# EAGLE design Midiot (EAGLE 5.10)

## Sheet 1 of 3
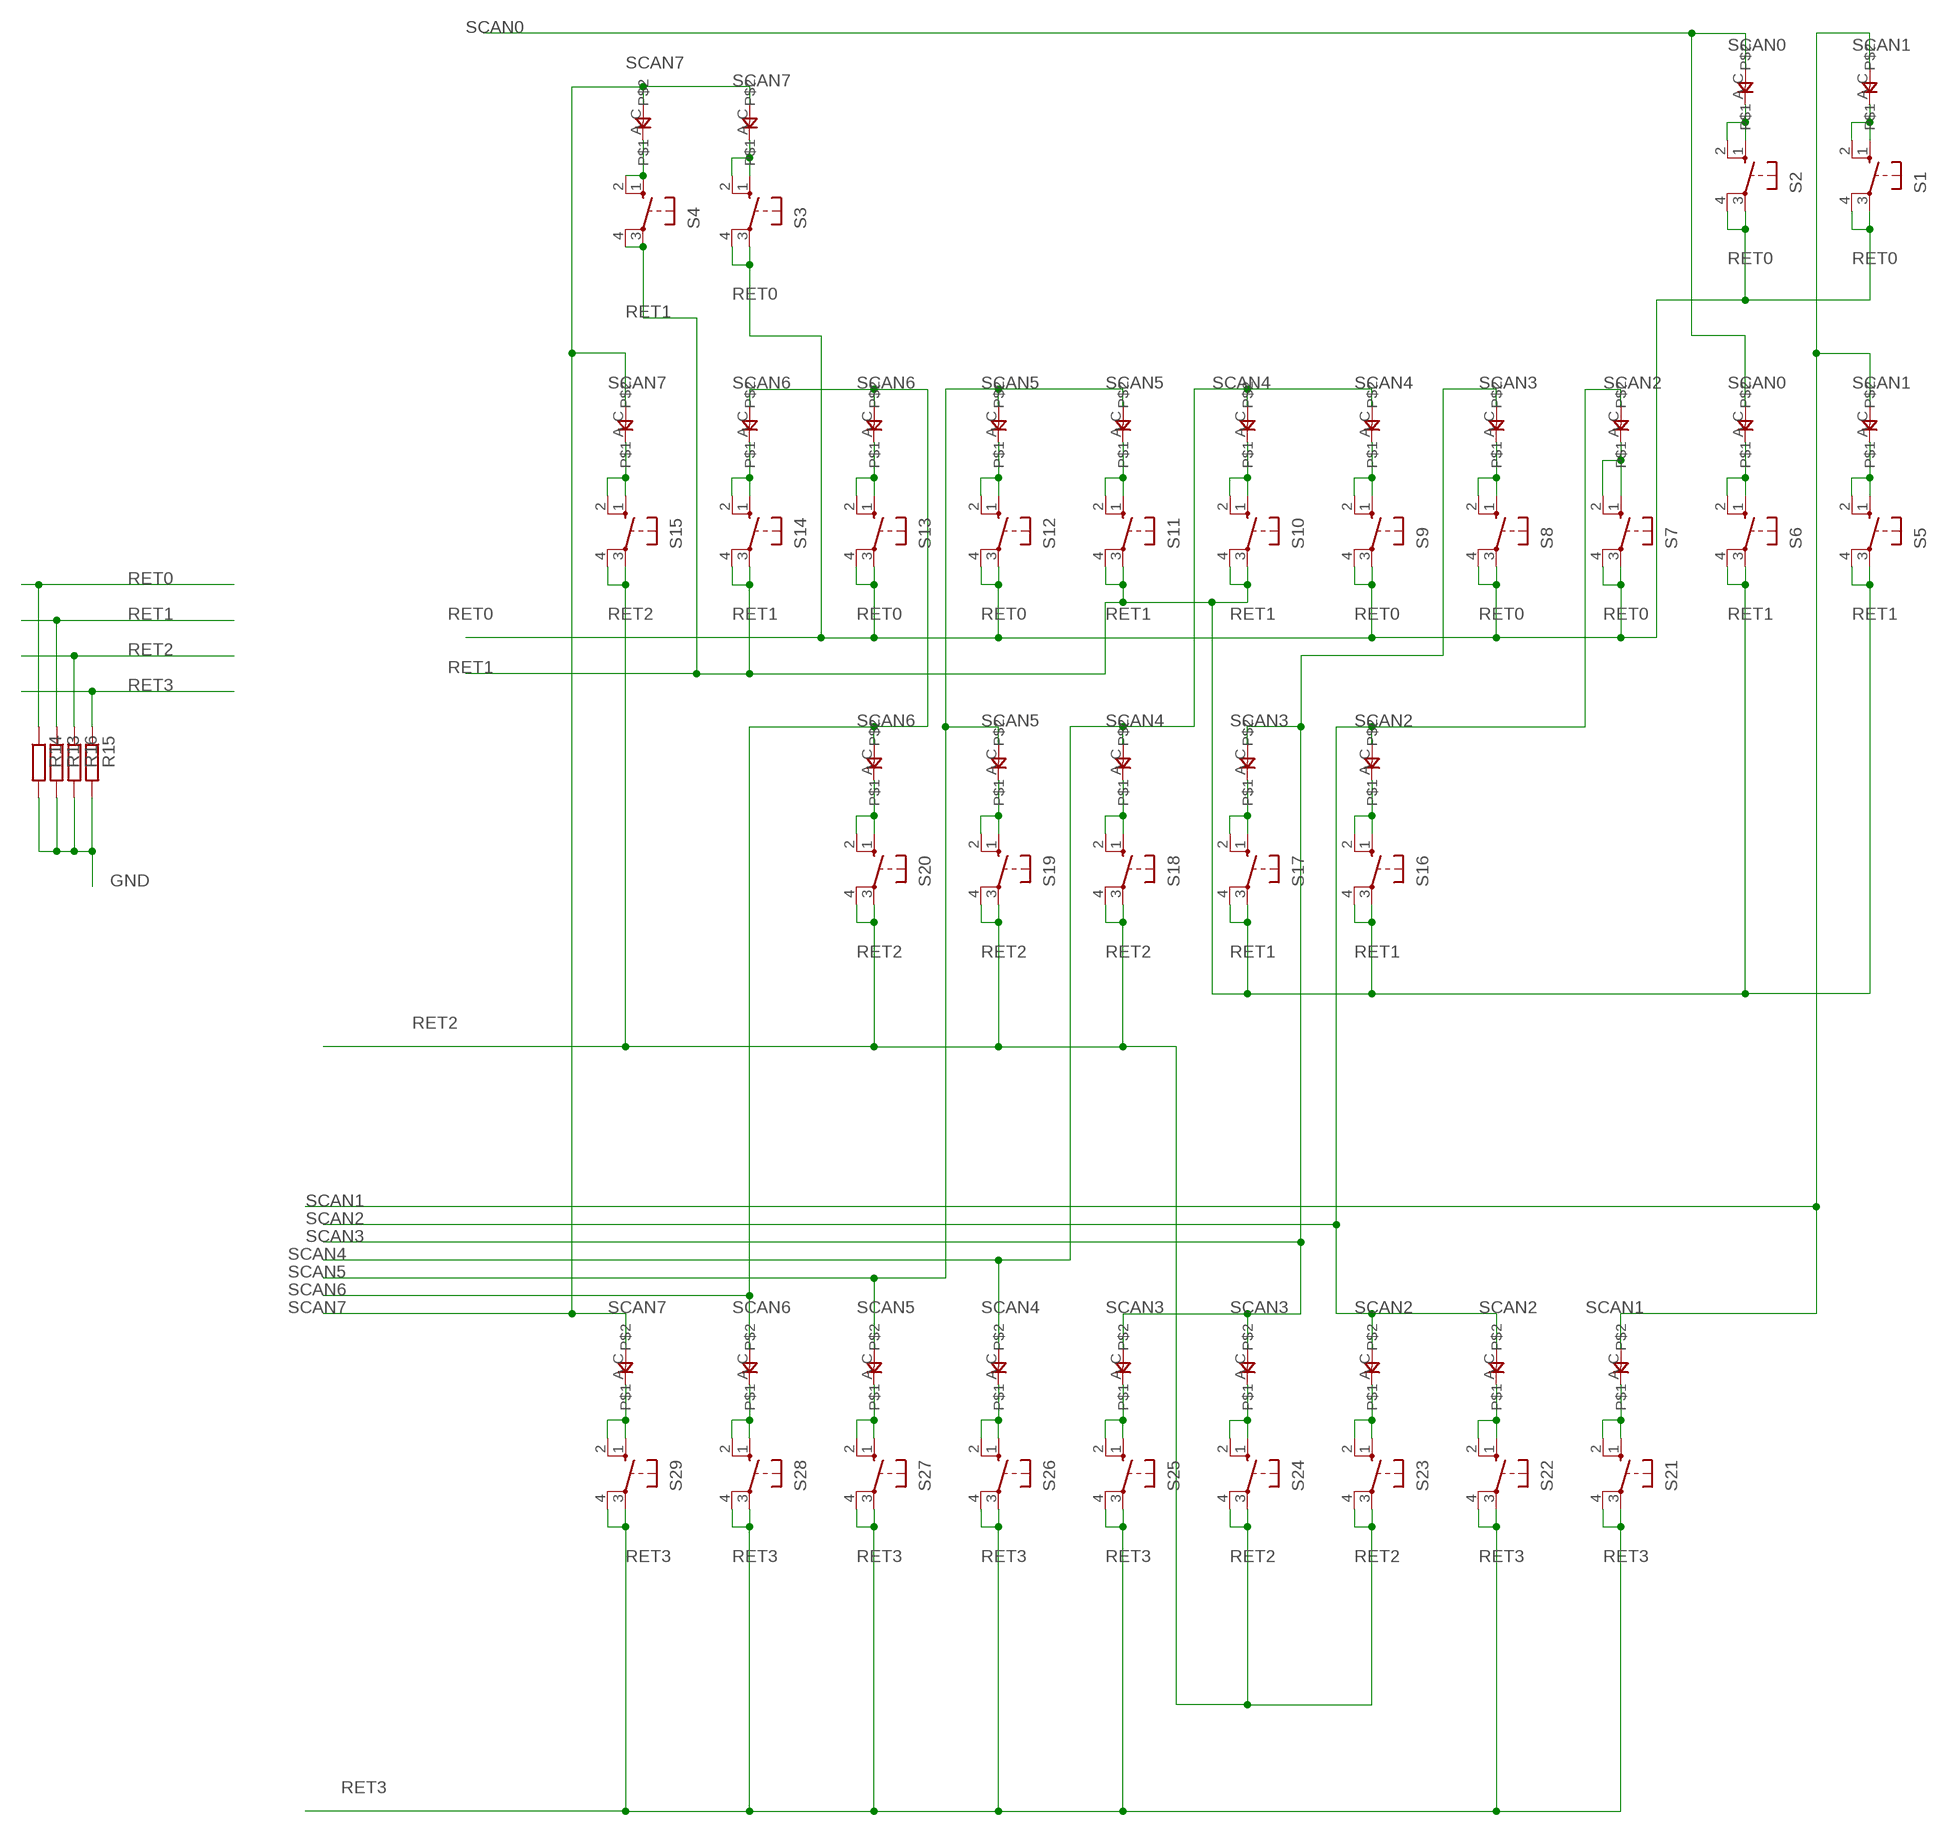
[diagram p0: schematic, sheet 1]

### Parts
R13  R-EU_R0805  [R0805]
R14  R-EU_R0805  [R0805]
R15  R-EU_R0805  [R0805]
R16  R-EU_R0805  [R0805]
S1  40-XX  [B3F-40XX]
S2  40-XX  [B3F-40XX]
S3  40-XX  [B3F-40XX]
S4  40-XX  [B3F-40XX]
S5  40-XX  [B3F-40XX]
S6  40-XX  [B3F-40XX]
S7  40-XX  [B3F-40XX]
S8  40-XX  [B3F-40XX]
S9  40-XX  [B3F-40XX]
S10  40-XX  [B3F-40XX]
S11  40-XX  [B3F-40XX]
S12  40-XX  [B3F-40XX]
S13  40-XX  [B3F-40XX]
S14  40-XX  [B3F-40XX]
S15  40-XX  [B3F-40XX]
S16  40-XX  [B3F-40XX]
S17  40-XX  [B3F-40XX]
S18  40-XX  [B3F-40XX]
S19  40-XX  [B3F-40XX]
S20  40-XX  [B3F-40XX]
S21  40-XX  [B3F-40XX]
S22  40-XX  [B3F-40XX]
S23  40-XX  [B3F-40XX]
S24  40-XX  [B3F-40XX]
S25  40-XX  [B3F-40XX]
S26  40-XX  [B3F-40XX]
S27  40-XX  [B3F-40XX]
S28  40-XX  [B3F-40XX]
S29  40-XX  [B3F-40XX]
U$1  0805DIODE  [0805DIODE]
U$5  0805DIODE  [0805DIODE]
U$6  0805DIODE  [0805DIODE]
U$7  0805DIODE  [0805DIODE]
U$8  0805DIODE  [0805DIODE]
U$9  0805DIODE  [0805DIODE]
U$10  0805DIODE  [0805DIODE]
U$11  0805DIODE  [0805DIODE]
U$12  0805DIODE  [0805DIODE]
U$13  0805DIODE  [0805DIODE]
U$14  0805DIODE  [0805DIODE]
U$15  0805DIODE  [0805DIODE]
U$16  0805DIODE  [0805DIODE]
U$17  0805DIODE  [0805DIODE]
U$18  0805DIODE  [0805DIODE]
U$19  0805DIODE  [0805DIODE]
U$20  0805DIODE  [0805DIODE]
U$21  0805DIODE  [0805DIODE]
U$22  0805DIODE  [0805DIODE]
U$23  0805DIODE  [0805DIODE]
U$24  0805DIODE  [0805DIODE]
U$25  0805DIODE  [0805DIODE]
U$26  0805DIODE  [0805DIODE]
U$27  0805DIODE  [0805DIODE]
U$28  0805DIODE  [0805DIODE]
U$29  0805DIODE  [0805DIODE]
U$30  0805DIODE  [0805DIODE]
U$31  0805DIODE  [0805DIODE]
U$32  0805DIODE  [0805DIODE]

### Nets
GND: R13.2 R14.2 R15.2 R16.2 ; also sheet 2,3
N$6: S3.1(S) S3.2(S1) U$30.A
N$13: S2.1(S) S2.2(S1) U$31.A
N$14: S1.1(S) S1.2(S1) U$32.A
N$15: S4.1(S) S4.2(S1) U$29.A
N$16: S7.1(S) S7.2(S1) U$26.A
N$17: S5.1(S) S5.2(S1) U$28.A
N$18: S15.1(S) S15.2(S1) U$18.A
N$19: S14.1(S) S14.2(S1) U$19.A
N$20: S9.1(S) S9.2(S1) U$24.A
N$21: S10.1(S) S10.2(S1) U$23.A
N$22: S6.1(S) S6.2(S1) U$27.A
N$23: S11.1(S) S11.2(S1) U$22.A
N$24: S12.1(S) S12.2(S1) U$21.A
N$25: S13.1(S) S13.2(S1) U$20.A
N$26: S20.1(S) S20.2(S1) U$13.A
N$27: S19.1(S) S19.2(S1) U$14.A
N$28: S18.1(S) S18.2(S1) U$15.A
N$29: S17.1(S) S17.2(S1) U$16.A
N$30: S16.1(S) S16.2(S1) U$17.A
N$31: S28.1(S) S28.2(S1) U$5.A
N$32: S27.1(S) S27.2(S1) U$6.A
N$33: S29.1(S) S29.2(S1) U$1.A
N$34: S26.1(S) S26.2(S1) U$7.A
N$35: S25.1(S) S25.2(S1) U$8.A
N$36: S24.1(S) S24.2(S1) U$9.A
N$37: S23.1(S) S23.2(S1) U$10.A
N$38: S22.1(S) S22.2(S1) U$11.A
N$39: S21.1(S) S21.2(S1) U$12.A
N$40: S8.1(S) S8.2(S1) U$25.A
RET0: R14.1 S1.3(P) S1.4(P1) S2.3(P) S2.4(P1) S3.3(P) S3.4(P1) S7.3(P) S7.4(P1) S8.3(P) S8.4(P1) S9.3(P) S9.4(P1) S12.3(P) S12.4(P1) S13.3(P) S13.4(P1) ; also sheet 3
RET1: R13.1 S4.3(P) S4.4(P1) S5.3(P) S5.4(P1) S6.3(P) S6.4(P1) S10.3(P) S10.4(P1) S11.3(P) S11.4(P1) S14.3(P) S14.4(P1) S16.3(P) S16.4(P1) S17.3(P) S17.4(P1) ; also sheet 3
RET2: R16.1 S15.3(P) S15.4(P1) S18.3(P) S18.4(P1) S19.3(P) S19.4(P1) S20.3(P) S20.4(P1) S23.3(P) S23.4(P1) S24.3(P) S24.4(P1) ; also sheet 3
RET3: R15.1 S21.3(P) S21.4(P1) S22.3(P) S22.4(P1) S25.3(P) S25.4(P1) S26.3(P) S26.4(P1) S27.3(P) S27.4(P1) S28.3(P) S28.4(P1) S29.3(P) S29.4(P1) ; also sheet 3
SCAN0: U$27.C U$31.C ; also sheet 3
SCAN1: U$12.C U$28.C U$32.C ; also sheet 3
SCAN2: U$10.C U$11.C U$17.C U$26.C ; also sheet 2,3
SCAN3: U$8.C U$9.C U$16.C U$25.C ; also sheet 2,3
SCAN4: U$7.C U$15.C U$23.C U$24.C ; also sheet 2,3
SCAN5: U$6.C U$14.C U$21.C U$22.C ; also sheet 3
SCAN6: U$5.C U$13.C U$19.C U$20.C ; also sheet 2,3
SCAN7: U$1.C U$18.C U$29.C U$30.C ; also sheet 2,3

## Sheet 2 of 3
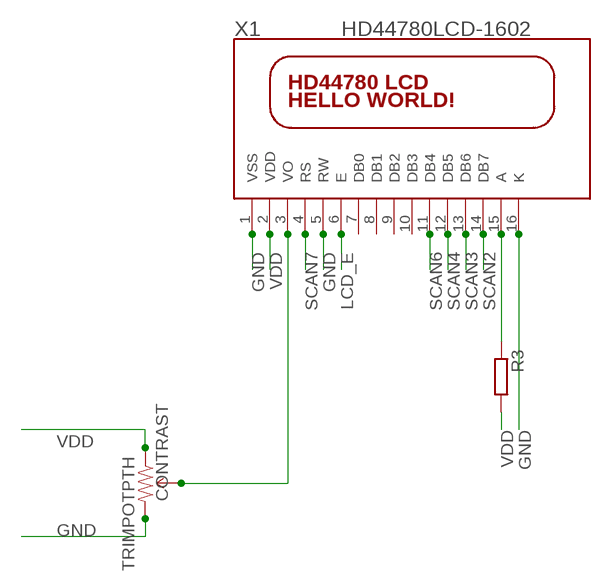
[diagram p1: schematic, sheet 2]

### Parts
CONTRAST  TRIMPOTPTH  [TRIM_POT_PTH]
R3  R-EU_R0805  [R0805]
X1  HD44780LCD-1602  [LCD1602]

### Nets
GND: CONTRAST.3(CW) X1.1(VSS) X1.5(RW) X1.16(K) ; also sheet 1,3
LCD_A: R3.1 X1.15(A)
LCD_E: X1.6(E) ; also sheet 3
LCD_VO: CONTRAST.2(WIPER) X1.3(VO)
SCAN2: X1.14(DB7) ; also sheet 1,3
SCAN3: X1.13(DB6) ; also sheet 1,3
SCAN4: X1.12(DB5) ; also sheet 1,3
SCAN6: X1.11(DB4) ; also sheet 1,3
SCAN7: X1.4(RS) ; also sheet 1,3
VDD: CONTRAST.1(CCW) R3.2 X1.2(VDD) ; also sheet 3
Unconnected: X1.7(DB0) X1.8(DB1) X1.9(DB2) X1.10(DB3)

## Sheet 3 of 3
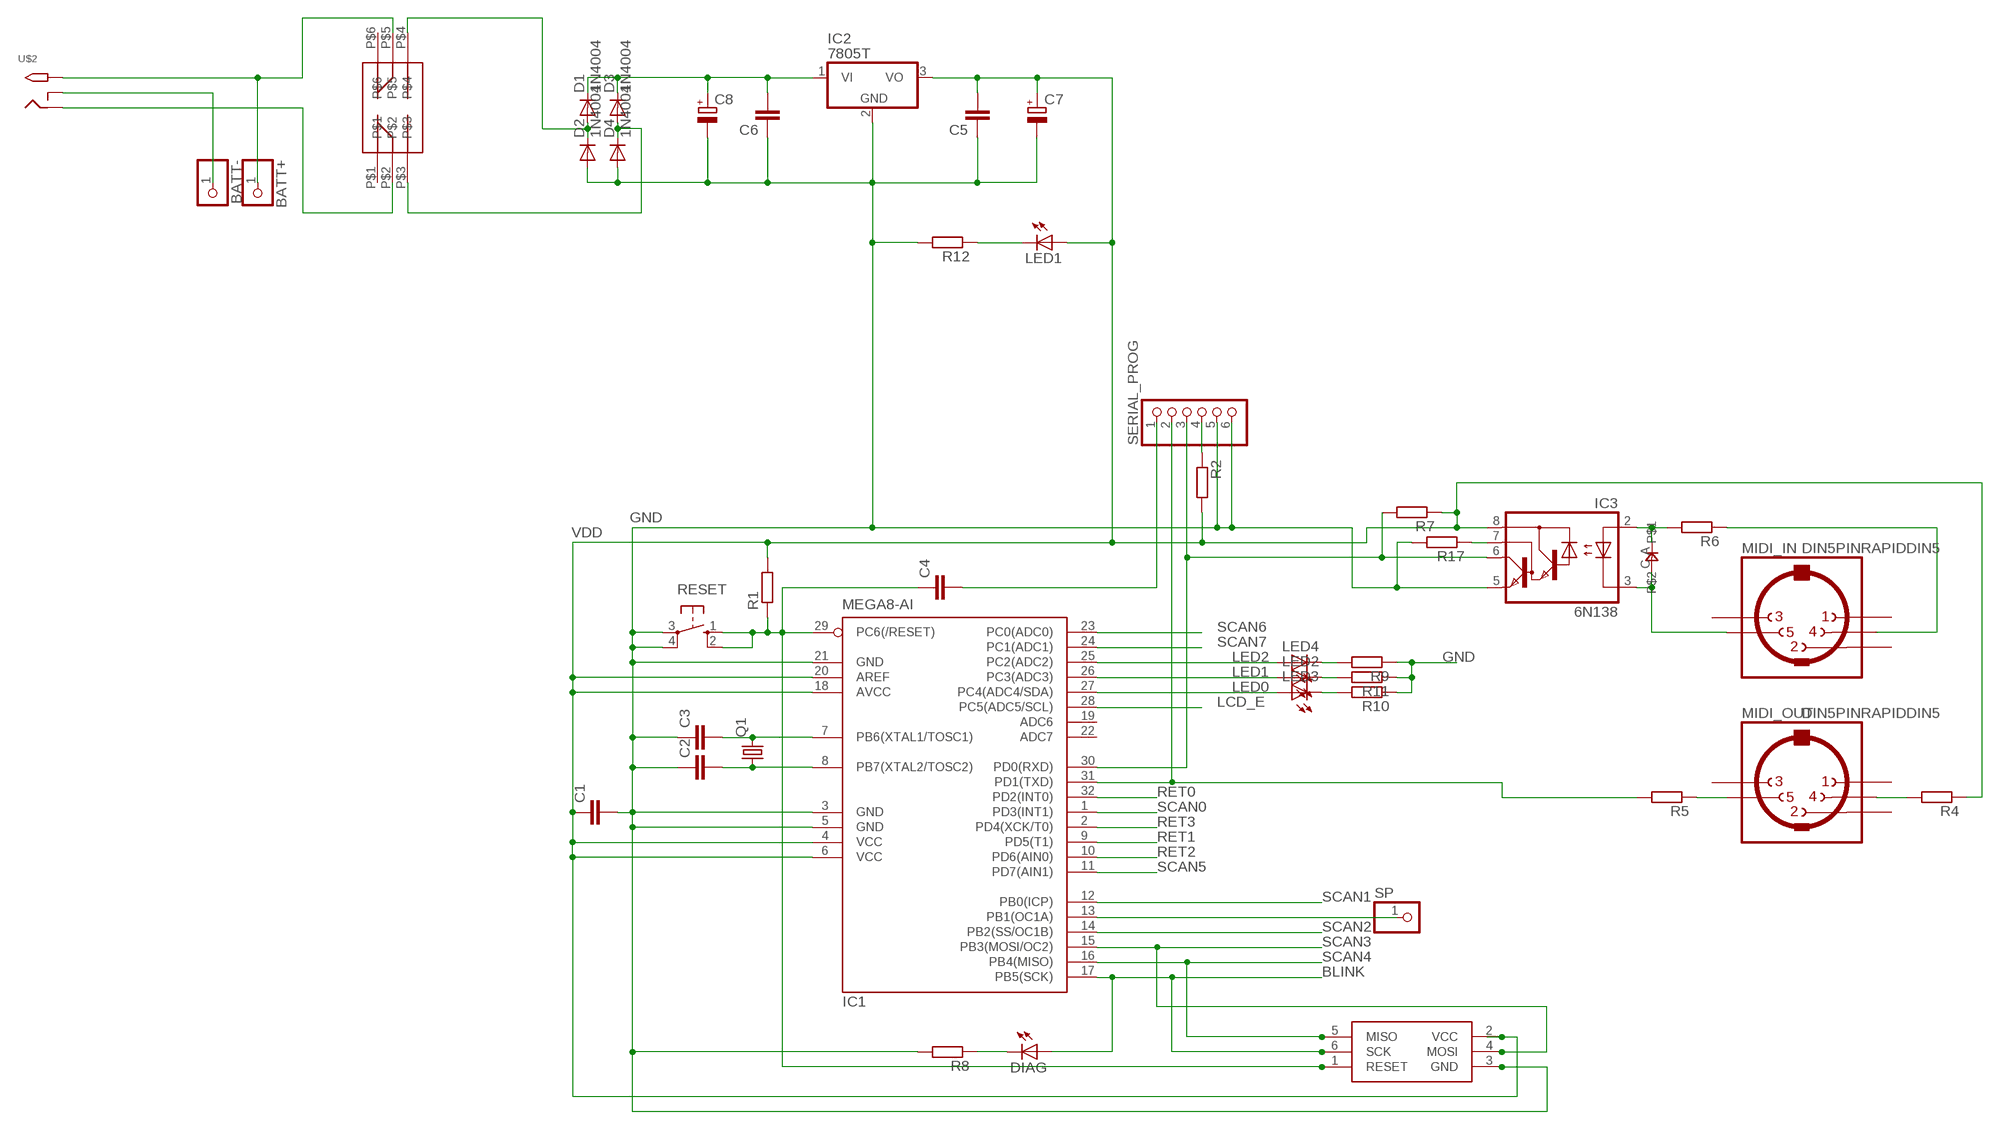
[diagram p2: schematic, sheet 3]

### Parts
BATT+  HEADER-1X1  [1X01_OVAL]
BATT-  HEADER-1X1  [1X01_OVAL]
C1  C-EUC0805  [C0805]
C2  C-EUC0805  [C0805]
C3  C-EUC0805  [C0805]
C4  C-EUC0805  [C0805]
C5  C-EUC0805  [C0805]
C6  C-EUC0805  [C0805]
C7  CPOL-EUE2.5-6  [E2,5-6]
C8  CPOL-EUE2.5-6  [E2,5-6]
D1  1N4004  [DO-VERT]
D2  1N4004  [DO-VERT]
D3  1N4004  [DO-VERT]
D4  1N4004  [DO-VERT]
D5  0805DIODE  [0805DIODE]
DIAG  LEDCHIP-LED0805  [CHIP-LED0805]
IC1  MEGA8-AI  [TQFP32-08]
IC2  7805T  [TO220H]
IC3  6N138  [DIL08]
LED1  LED3MM  [LED3MM]
LED2  LED3MM  [LED3MM]
LED3  LED3MM  [LED3MM]
LED4  LED3MM  [LED3MM]
MIDI_IN  DIN5PINRAPIDDIN5  [RAPIDDIN5]
MIDI_OUT  DIN5PINRAPIDDIN5  [RAPIDDIN5]
Q1  CRYSTALHC49S  [HC49/S]
R1  R-EU_R0805  [R0805]
R2  R-EU_R0805  [R0805]
R4  R-EU_R0805  [R0805]
R5  R-EU_R0805  [R0805]
R6  R-EU_R0805  [R0805]
R7  R-EU_R0805  [R0805]
R8  R-EU_R0805  [R0805]
R9  R-EU_R0805  [R0805]
R10  R-EU_R0805  [R0805]
R11  R-EU_R0805  [R0805]
R12  R-EU_R0805  [R0805]
R17  R-EU_R0805  [R0805]
RESET  10-XX  [B3F-10XX]
SERIAL_PROG  PINHD-1X6  [1X06]
SP  HEADER-1X1  [1X01_OVAL]
U$2  2.1MMJACKTHM  [PJ-102A]
U$3  2P2T_LATCHING  [2P2T_LATCHING]
U$34  TAG_CONN_AVR  [TC2030-MCP-NL]

### Nets
BLINK: DIAG.A IC1.17(PB5(SCK)) U$34.6(SCK)
GND: C1.2 C2.1 C3.1 C5.1 C6.1 C7.- C8.- D2.A D4.A IC1.3(GND) IC1.5(GND) IC1.21(GND) IC2.2(GND) IC3.5(GND) R8.2 R9.1 R10.1 R11.1 R12.2 R17.2 RESET.3(P) RESET.4(P1) SERIAL_PROG.5 SERIAL_PROG.6 U$34.3(GND) ; also sheet 1,2
LCD_E: IC1.28(PC5(ADC5/SCL)) ; also sheet 2
LED0: IC1.27(PC4(ADC4/SDA)) LED3.A
LED1: IC1.26(PC3(ADC3)) LED2.A
LED2: IC1.25(PC2(ADC2)) LED4.A
N$1: LED4.K(C) R9.2
N$2: LED2.K(C) R11.2
N$3: LED3.K(C) R10.2
N$4: C3.2 IC1.7(PB6(XTAL1/TOSC1)) Q1.2
N$5: C2.2 IC1.8(PB7(XTAL2/TOSC2)) Q1.1
N$7: C4.1 IC1.29(PC6(/RESET)) R1.1 RESET.1(S) RESET.2(S1) U$34.1(RESET)
N$8: R2.1 SERIAL_PROG.4
N$9: C4.2 SERIAL_PROG.1
N$10: IC1.31(PD1(TXD)) R5.2 SERIAL_PROG.2
N$11: IC1.30(PD0(RXD)) IC3.6(VO) R7.2 SERIAL_PROG.3
N$12: C6.2 C8.+ D1.C D3.C IC2.1(VI)
N$41: BATT+.1 U$2.TIP U$3.P$5
N$42: U$2.RING U$3.P$2
N$43: BATT-.1 U$2.RING_SW
N$44: IC3.7(VB) R17.1
N$45: D5.A IC3.2(A) R6.2
N$46: D5.C IC3.3(C) MIDI_IN.5
N$47: MIDI_IN.4 R6.1
N$48: MIDI_OUT.5 R5.1
N$49: MIDI_OUT.4 R4.2
N$50: DIAG.C R8.1
N$51: LED1.K(C) R12.1
N$52: IC1.13(PB1(OC1A)) SP.1
N$55: D3.A D4.C U$3.P$3
N$56: D1.A D2.C U$3.P$4
RET0: IC1.32(PD2(INT0)) ; also sheet 1
RET1: IC1.9(PD5(T1)) ; also sheet 1
RET2: IC1.10(PD6(AIN0)) ; also sheet 1
RET3: IC1.2(PD4(XCK/T0)) ; also sheet 1
SCAN0: IC1.1(PD3(INT1)) ; also sheet 1
SCAN1: IC1.12(PB0(ICP)) ; also sheet 1
SCAN2: IC1.14(PB2(SS/OC1B)) ; also sheet 1,2
SCAN3: IC1.15(PB3(MOSI/OC2)) U$34.4(MOSI) ; also sheet 1,2
SCAN4: IC1.16(PB4(MISO)) U$34.5(MISO) ; also sheet 1,2
SCAN5: IC1.11(PD7(AIN1)) ; also sheet 1
SCAN6: IC1.23(PC0(ADC0)) ; also sheet 1,2
SCAN7: IC1.24(PC1(ADC1)) ; also sheet 1,2
VDD: C1.1 C5.2 C7.+ IC1.4(VCC) IC1.6(VCC) IC1.18(AVCC) IC1.20(AREF) IC2.3(VO) IC3.8(VCC) LED1.A R1.2 R2.2 R4.1 R7.1 U$34.2(VCC) ; also sheet 2
Unconnected: IC1.19(ADC6) IC1.22(ADC7) MIDI_IN.1 MIDI_IN.2 MIDI_IN.3 MIDI_OUT.1 MIDI_OUT.2 MIDI_OUT.3 U$3.P$1 U$3.P$6

## Library data of the parts
BATT+ BATT- SP = microbuilder:HEADER-1X1: PIN HEADER
C1-C6 = rcl:C-EU: CAPACITOR, European symbol
C7 C8 = rcl:CPOL-EU: POLARIZED CAPACITOR, European symbol
CONTRAST = SparkFun:TRIMPOT
D1-D4 = jasons_stuff:1N4004: DIODE general purpose rectifier, 1 A
D5 U$1 U$5-U$32 = jasons_stuff:0805DIODE
DIAG LED1-LED4 = adafruit:LED: LED OSRAM: - CHIPLED LG R971, LG N971, LY N971, LG Q971, LY Q971, LO R971, LY R971 LH N974, LH R974 LS Q976, LO Q976, LY Q976 LO Q996 - Hyper CHIPLED LW Q18S LB Q993, LB Q99A, LB R99A - SideLED LS A670, LO A670, LY A670, LG A670, LP A670 LB A673, LV A673, LT A673, LW A673 LH A674 LY A675 LS A676, LA A676, LO A676, LY A676, LW A676 LS A679, LY A679, LG A679 - Hyper Micro SIDELED® LS Y876, LA Y876, LO Y876, LY Y876 LT Y87S - SmartLED LW L88C, LW L88S LB L89C, LB L89S, LG L890 LS L89K, LO L89K, LY L89K LS L896, LA L896, LO L896, LY L896 - TOPLED LS T670, LO T670, LY T670, LG T670, LP T670 LSG T670, LSP T670, LSY T670, LOP T670, LYG T670 LG T671, LOG T671, LSG T671 LB T673, LV T673, LT T673, LW T673 LH T674 LS T676, LA T676, LO T676, LY T676, LB T676, LH T676, LSB T676, LW T676 LB T67C, LV T67C, LT T67C, LS T67K, LO T67K, LY T67K, LW E67C LS E67B, LA E67B, LO E67B, LY E67B, LB E67C, LV E67C, LT E67C LW T67C LS T679, LY T679, LG T679 LS T770, LO T770, LY T770, LG T770, LP T770 LB T773, LV T773, LT T773, LW T773 LH T774 LS E675, LA E675, LY E675, LS T675 LS T776, LA T776, LO T776, LY T776, LB T776 LHGB T686 LT T68C, LB T68C - Hyper Mini TOPLED® LB M676 - Mini TOPLED Santana® LG M470 LS M47K, LO M47K, LY M47K Source: http://www.osram.convergy.de/
IC1 = atmel:MEGA8: MICROCONTROLLER 8 Kbytes FLASH, 1 kbytes SRAM, 512 bytes EEPROM, USART, 6-channel 10 bit ADC, 2-channel 8 bit ADC Pin compatible with Atmega48, ATMega88, ATMega168 Source: avr.lbr
IC2 = linear:78*: Positive VOLTAGE REGULATOR Source: http://cache.national.com/ds/LM/LM78L05.pdf http://www.fairchildsemi.com/ds/LM/LM7805.pdf
IC3 = optocoupler:6N138: MOTOROLA OPTO COUPLER
MIDI_IN MIDI_OUT = jasons_stuff:DIN5PIN: Female CONNECTOR 5 pins 90 deg. with shield, horizontal (DIN 41524)
Q1 = crystal:CRYSTAL: CRYSTAL
R1-R17 = rcl:R-EU_: RESISTOR, European symbol
RESET = switch-omron:10-XX: OMRON SWITCH
S1-S29 = switch-omron:40-XX: OMRON SWITCH
SERIAL_PROG = pinhead:PINHD-1X6: PIN HEADER
U$2 = adafruit:2.1MMJACK: 2.1mm x 5.5mm THM DC jack with internal switch. Digikey part #PJ-102A, 4UCON part #05537 2.1mm x 5.5mm SMT DC jack with internal switch. Digikey part #PJ-002A-SMT, 4UCON part #03267 By microbuilder.eu & adafruit.com
U$3 = jasons_stuff:2P2T_LATCHING
U$34 = jasons_stuff:TAG_CONN_AVR
X1 = adafruit:HD44780LCD: HD44780 LCD Standard character type LCDs, available in sizes from 8x1 to 40x4!

## Board
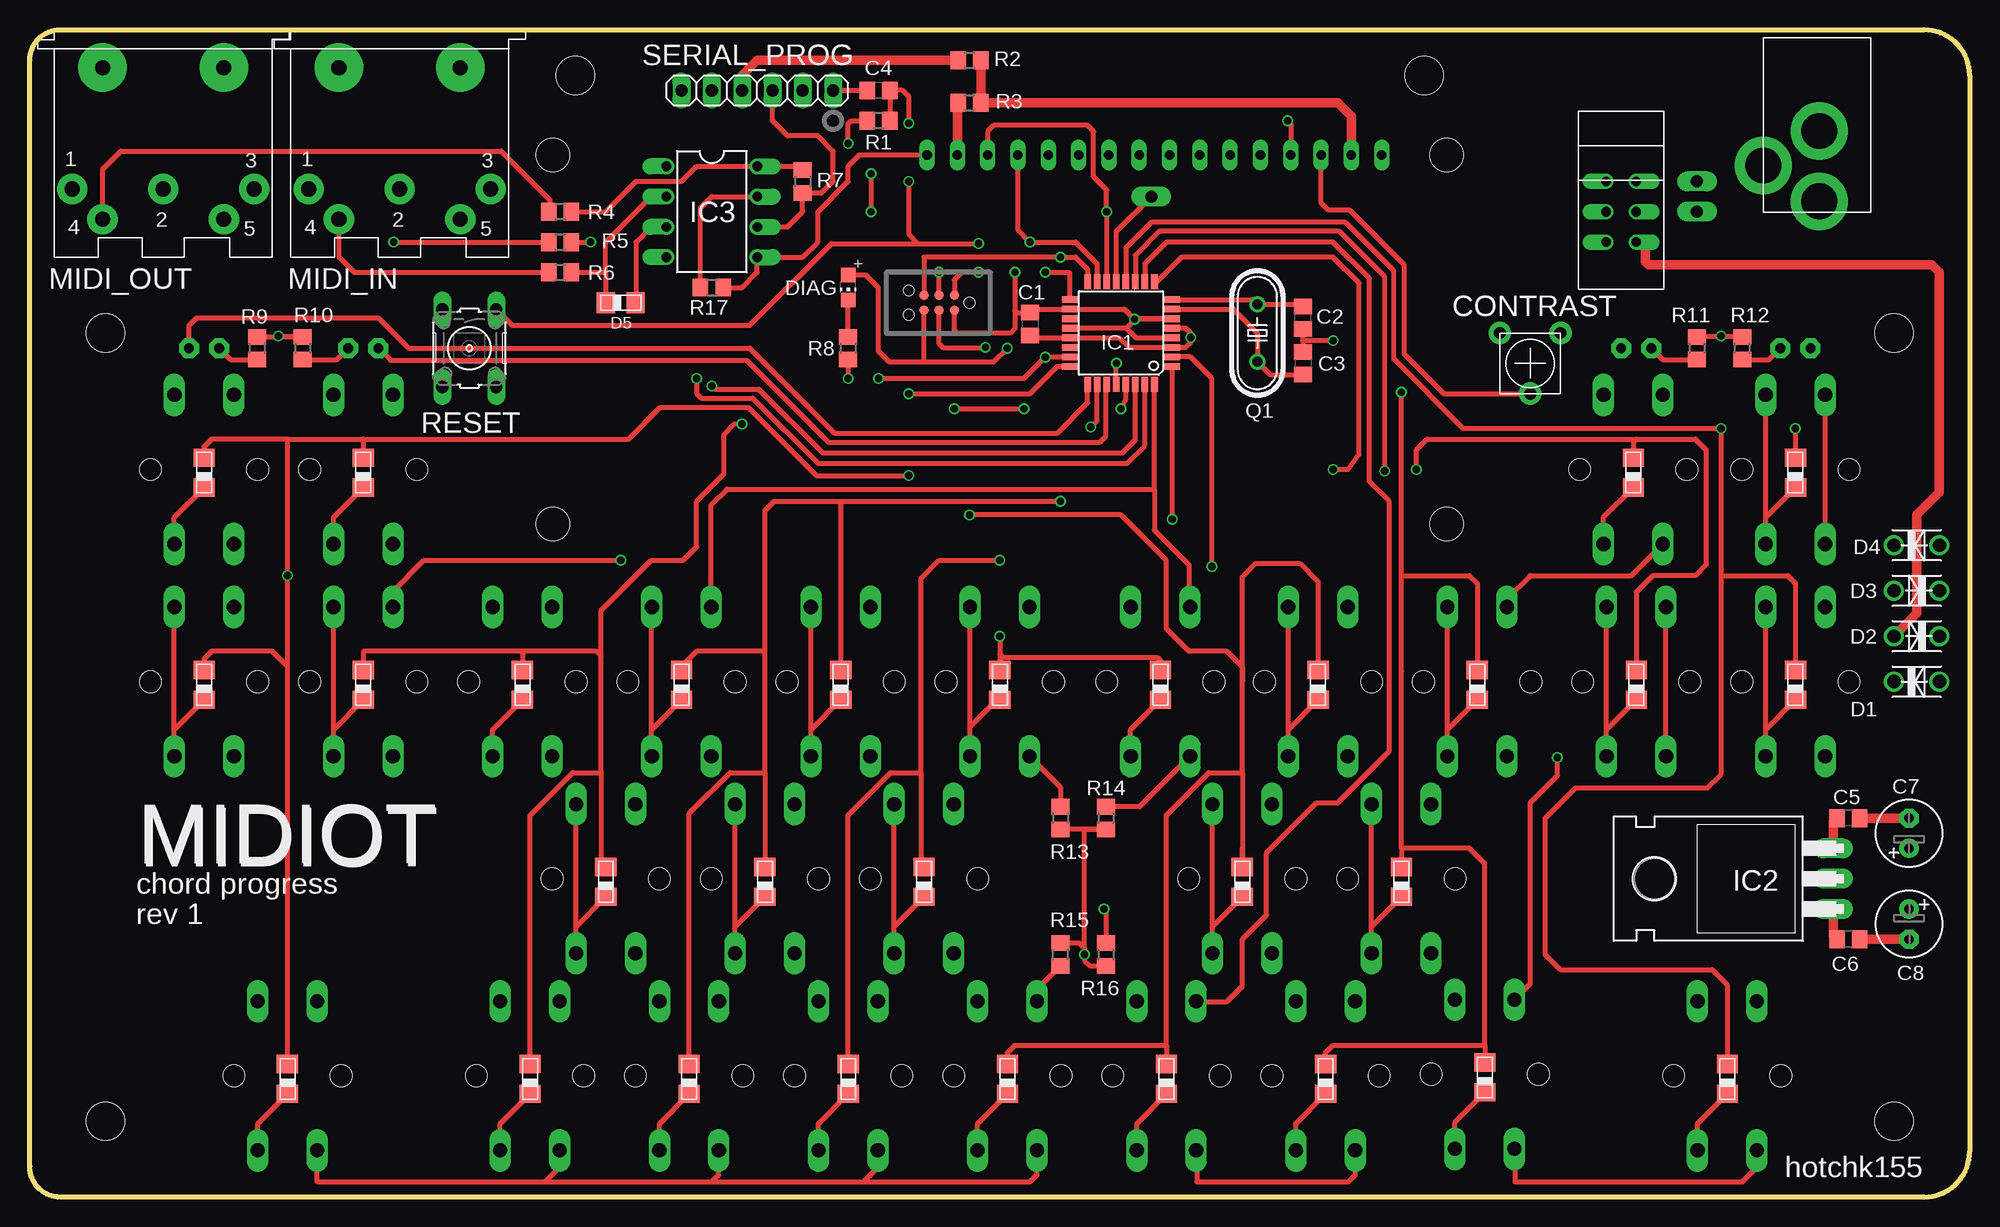
[diagram p3: board, top side]
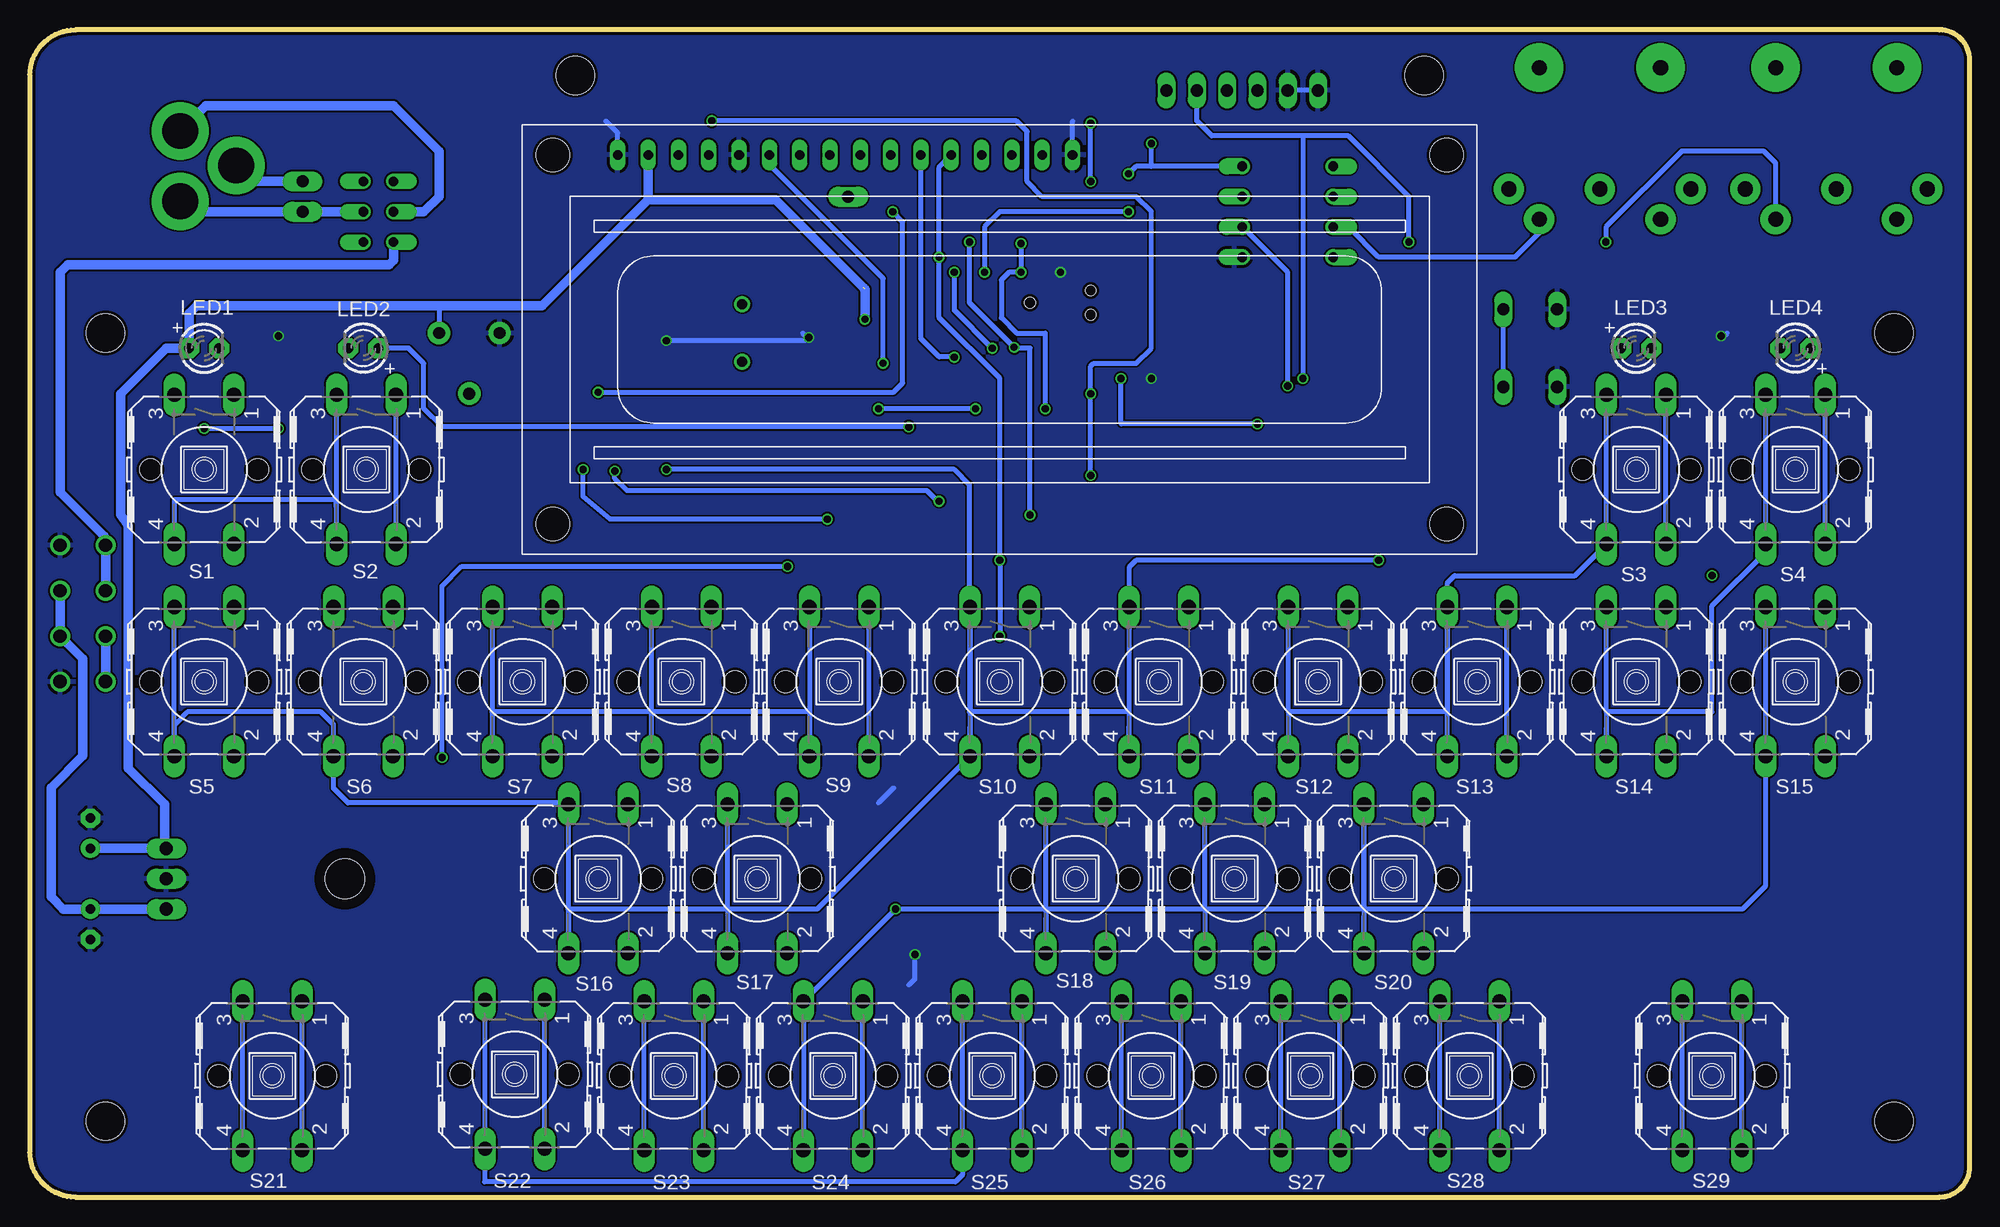
[diagram p4: board, bottom side, seen from below]

Size 162.56 x 97.79 mm. Coordinates in mm from the lower left corner, seen from the top.
Outline: 162.56,93.98 162.56,3.81 arc-90 158.75,0 2.54,0 arc-90 0,2.54 0,95.25 arc-90 2.54,97.79 158.75,97.79 arc-90 162.56,93.98
Copper layers (1*16): Top 0.035mm / dielectric 1.5mm / Bottom 0.035mm
Design rules "ITEADstudio_DRC": minimum track width 6mil, minimum drill 12mil, track to track 6mil, track to pad 6mil, pad to pad 6mil, via to via 6mil, smd to smd 0mil, copper to edge 10mil, drill to drill 10mil, minimum pad ring 10mil, minimum via ring 6mil, stop-mask expansion 2mil, vias tented up to drill 100mil, thermal gap 10mil
Holes 3.2 mm at 156.21,72.39 156.21,6.35 6.35,72.39 6.35,6.35 45.72,93.98 116.84,93.98

### Footprints (pad centres in the part's own frame; a part is rotated, then mirrored left to right if it is on the bottom)
1X01_OVAL = drill 1 pad 1.676 long: 1 0,0
C0805 = smd 1.3 x 1.5: 1 -0.95,0; 2 0.95,0
E2,5-6 = drill 0.813 pad 1.6 round: + -1.27,0 | drill 0.813 pad 1.6 octagon: - 1.27,0
TRIM_POT_PTH = drill 1 pad 1.88 round: 1 -2.54,-2.54; 2 0,2.54; 3 2.54,-2.54
DO-VERT = drill 1.118 round: A 2.54,0; C -1.27,0
0805DIODE = smd 1.524 x 1.778: A -1.262,-0.005; C 1.238,-0.005
CHIP-LED0805 = smd 1.2 x 1.2: A 0,-1.05; C 0,1.05
TQFP32-08 = smd 1.27 x 0.559: 1 -4.293,2.8; 2 -4.293,2; 3 -4.293,1.2; 4 -4.293,0.4; 5 -4.293,-0.4; 6 -4.293,-1.2; 7 -4.293,-2; 8 -4.293,-2.8; 17 4.293,-2.8; 18 4.293,-2; 19 4.293,-1.2; 20 4.293,-0.4; 21 4.293,0.4; 22 4.293,1.2; 23 4.293,2; 24 4.293,2.8 | smd 0.559 x 1.27: 9 -2.8,-4.293; 10 -2,-4.293; 11 -1.2,-4.293; 12 -0.4,-4.293; 13 0.4,-4.293; 14 1.2,-4.293; 15 2,-4.293; 16 2.8,-4.293; 25 2.8,4.293; 26 2,4.293; 27 1.2,4.293; 28 0.4,4.293; 29 -0.4,4.293; 30 -1.2,4.293; 31 -2,4.293; 32 -2.8,4.293
TO220H = drill 1.118 long: 1 -2.54,-10.16; 2 0,-10.16; 3 2.54,-10.16 | hole 3.302: 0,4.826
DIL08 = drill 0.813 offset: 1 -3.81,-3.81; 2 -1.27,-3.81; 3 1.27,-3.81; 4 3.81,-3.81; 5 3.81,3.81; 6 1.27,3.81; 7 -1.27,3.81; 8 -3.81,3.81
LED3MM = drill 0.813 pad 1.676 octagon: A -1.27,0; K 1.27,0
RAPIDDIN5 = drill 1.27 pad 2.54 round: 1 7.62,5.08; 2 0,5.08; 3 -7.62,5.08; 4 5.08,7.62; 5 -5.08,7.62 | drill 1.27 pad 4.064 round: NC -5.08,-5.08; NC@ 5.08,-5.08
HC49/S = drill 0.813 round: 1 -2.413,0; 2 2.413,0
R0805 = smd 1.3 x 1.5: 1 -0.95,0; 2 0.95,0
B3F-10XX = drill 1.016 long: 1 -3.251,2.261; 2 3.251,2.261; 3 -3.251,-2.261; 4 3.251,-2.261
B3F-40XX = drill 1.194 long: 1 -6.248,2.489; 2 6.248,2.489; 3 -6.248,-2.489; 4 6.248,-2.489 | hole 1.803: 0,-4.496; 0,4.496
1X06 = drill 1.016 long: 1 -6.35,0; 2 -3.81,0; 3 -1.27,0; 4 1.27,0; 5 3.81,0; 6 6.35,0
PJ-102A = drill 3 pad 4.8 round: RING 0.1,-3.39; RING_SW -4.6,-6.29; TIP 0.1,-9.29
2P2T_LATCHING = drill 0.8 offset: P$1 -1.27,0; P$2 -1.27,-2.54; P$3 -1.27,-5.08; P$4 1.27,-5.08; P$5 1.27,-2.54; P$6 1.27,0
TC2030-MCP-NL = smd 0.787 x 0.787: 1 1.27,-0.635; 2 1.27,0.635; 3 2.54,-0.635; 4 2.54,0.635; 5 3.81,-0.635; 6 3.81,0.635 | hole 0.889: 0,0; 5.08,-1.016; 5.08,1.016
LCD1602 = drill 0.8 long: 1 8,33.46; 2 10.54,33.46; 3 13.08,33.46; 4 15.62,33.46; 5 18.16,33.46; 6 20.7,33.46; 7 23.24,33.46; 8 25.78,33.46; 9 28.32,33.46; 10 30.86,33.46; 11 33.4,33.46; 12 35.94,33.46; 13 38.48,33.46; 14 41.02,33.46; 15 43.56,33.46; 16 46.1,33.46 | hole 2.8: 2.54,2.54; 2.54,33.46; 77.46,33.46; 77.46,2.54

### Placement (x,y rotation side)
BATT+  139.7,82.55 90 top
BATT-  139.7,85.09 90 top
C1  83.82,73.15 270 top
C2  106.68,73.66 90 top
C3  106.68,69.85 270 top
C4  71.12,92.71 180 top
C5  152.4,31.75 180 top
C6  152.4,21.59 180 top
C7  157.48,30.48 90 top
C8  157.48,22.86 270 top
CONTRAST  125.73,69.85 180 top
D1  158.75,46.99 180 top
D2  157.48,43.18 0 top
D3  158.75,50.8 180 top
D4  157.48,54.61 0 top
D5  49.53,74.93 0 top
DIAG  68.58,76.2 180 top
IC1  91.44,72.39 180 top
IC2  140.97,26.67 90 top
IC3  57.15,82.55 270 top
LED1  147.95,71.12 0 bottom
LED2  134.62,71.12 180 bottom
LED3  27.94,71.12 0 bottom
LED4  14.61,71.12 180 bottom
MIDI_IN  30.99,89.53 180 top
MIDI_OUT  11.18,89.53 180 top
Q1  102.87,72.39 270 top
R1  71.12,90.17 180 top
R2  78.74,95.25 0 top
R3  78.74,91.69 0 top
R4  44.45,82.55 180 top
R5  44.45,80.01 0 top
R6  44.45,77.47 0 top
R7  64.77,85.09 270 top
R8  68.58,71.12 270 top
R9  19.05,71.12 270 top
R10  22.86,71.12 270 top
R11  139.7,71.12 270 top
R12  143.51,71.12 90 top
R13  86.36,31.75 270 top
R14  90.17,31.75 270 top
R15  86.36,20.32 90 top
R16  90.17,20.32 270 top
R17  57.15,76.2 0 top
RESET  36.83,71.12 270 top
S1  147.95,60.96 270 bottom
S2  134.37,60.96 270 bottom
S3  27.94,60.96 270 bottom
S4  14.61,60.96 270 bottom
S5  147.95,43.18 270 bottom
S6  134.62,43.18 270 bottom
S7  121.29,43.18 270 bottom
S8  107.95,43.18 270 bottom
S9  94.74,43.18 270 bottom
S10  81.28,43.18 270 bottom
S11  67.95,43.18 270 bottom
S12  54.61,43.18 270 bottom
S13  41.27,43.18 270 bottom
S14  27.94,43.18 270 bottom
S15  14.61,43.18 270 bottom
S16  114.94,26.67 270 bottom
S17  101.6,26.67 270 bottom
S18  74.93,26.67 270 bottom
S19  61.59,26.67 270 bottom
S20  48.26,26.67 270 bottom
S21  142.24,10.16 270 bottom
S22  121.92,10.29 270 bottom
S23  108.59,10.16 270 bottom
S24  95.25,10.16 270 bottom
S25  81.92,10.16 270 bottom
S26  68.58,10.16 270 bottom
S27  55.24,10.16 270 bottom
S28  41.91,10.16 270 bottom
S29  21.59,10.16 270 bottom
SERIAL_PROG  60.96,92.71 180 top
SP  93.98,83.82 90 top
U$1  21.59,9.91 90 top
U$2  149.86,92.71 0 top
U$3  133.35,85.09 0 top
U$5  41.91,9.91 90 top
U$6  55.24,9.91 90 top
U$7  68.58,9.91 90 top
U$8  81.92,9.91 90 top
U$9  95.25,9.91 90 top
U$10  108.59,9.91 90 top
U$11  121.92,10.03 90 top
U$12  142.24,9.91 90 top
U$13  48.26,26.42 90 top
U$14  61.59,26.42 90 top
U$15  74.93,26.42 90 top
U$16  101.6,26.42 90 top
U$17  114.94,26.42 90 top
U$18  14.61,42.93 90 top
U$19  27.94,42.93 90 top
U$20  41.27,42.93 90 top
U$21  54.61,42.93 90 top
U$22  67.95,42.93 90 top
U$23  81.28,42.93 90 top
U$24  94.74,42.93 90 top
U$25  107.95,42.93 90 top
U$26  121.29,42.93 90 top
U$27  134.62,42.93 90 top
U$28  147.95,42.93 90 top
U$29  14.61,60.71 90 top
U$30  27.94,60.71 90 top
U$31  134.37,60.71 90 top
U$32  147.95,60.71 90 top
U$34  78.74,74.93 180 top
X1  121.29,53.85 0 bottom

### Tracks (layer width: path | path; a pad name or v marks a point on that pad's centre or on a via)
BLINK  (via drill 0.6)
  Top 0.406: v85.09,77.47 87.12,77.47 87.12,75.21 IC1.17 | DIAG.A 70.07,77.25 71.12,76.2 71.12,70.87 72.01,69.98 74.93,69.98 | 74.93,69.98 U$34.6 | v81.92,71.12 80.77,69.98 74.93,69.98
  Bottom 0.406: v85.09,77.47 85.09,74.29 v81.92,71.12
GND  (via drill 0.6)
  Top 0.406: 106.68,71.75 C3.1 | R12.2 143.44,72.14 v141.73,72.14 139.77,72.14 R11.1 | R9.1 R10.1 20.89,72.07 v20.83,72.14 | 68.26,69.85 R8.2 v68.58,68.58 | IC1.5 96.88,72.79 97.28,72.39 v97.28,72.01 97.28,71.63 96.84,71.19 IC1.3 92.13,71.19 91.33,71.99 IC1.21 84.03,71.99 C1.2 | X1.16 69.53,87.31 68.58,86.36 68.58,85.09 66.04,82.55 66.04,80.01 64.77,78.74 IC3.5 60.96,77.47 59.69,76.2 R17.2 | 106.68,71.75 C2.1 | v109.22,71.75 106.68,71.75 | 90.17,19.05 R16.2 88.83,19.37 88.39,19.81 v88.39,20.32 88.39,20.83 | R15.2 87.95,21.27 88.39,20.83 | R13.2 R14.2 88.33,30.8 88.39,30.73 88.39,20.83 | U$34.3 v76.2,77.47
  Top 0.813: C6.1 C8.- | C5.1 C7.-
  Bottom 0.406: X1.16 75.19,90.15 | SERIAL_PROG.6 SERIAL_PROG.5 | X1.1 113.29,89.15 114.3,90.17 | 97.79,72.39 97.41,72.01 v97.28,72.01 97.54,71.75 v109.22,71.75 | 90.17,34.29 91.44,33.02 | v20.83,72.14 20.57,72.14 20.32,72.39 | v88.39,20.32 88.39,18.29 88.9,17.78
  pour Bottom: -13.97,100.33 -13.97,-2.54 168.91,-1.27 168.91,101.6
LCD_A
  Top 0.406: X1.15
  Top 0.813: X1.15 77.73,91.63 R3.1
LCD_E  (via drill 0.6)
  Top 0.406: IC1.28 91.04,69.83 v91.06,69.85
  Bottom 0.406: v91.06,69.85 91.06,76.96 100.58,86.49 X1.6
LCD_VO
  Top 0.406: CONTRAST.2 118.49,67.31 115.19,70.61 115.19,78.1 110.62,82.68 108.84,82.68 108.2,83.31 X1.3
LED0
  Top 0.406: IC1.27 90.17,68.03 90.17,63.75 89.66,63.25 66.93,63.25 60.07,70.1 30.23,70.1 LED3.A
LED1  (via drill 0.6)
  Top 0.406: IC1.26 89.44,65.06 v88.9,64.52
  Bottom 0.406: LED2.A 130.81,71.12 129.54,69.85 129.54,66.04 128.02,64.52 v88.9,64.52
LED2
  Top 0.406: IC1.25 88.64,66.54 86.11,64.01 67.44,64.01 60.32,71.12 31.75,71.12 29.21,73.66 13.97,73.66 13.34,73.02 LED4.A
N$1
  Top 0.406: R9.2 16.82,70.17 LED4.K
N$2
  Top 0.406: R11.2 136.84,70.17 LED2.K
N$3
  Top 0.406: R10.2 25.72,70.17 LED3.K
N$4
  Top 0.406: C3.2 103.95,68.9 Q1.2 102.87,72.39 100.87,74.39 IC1.7
N$5
  Top 0.406: C2.2 106.49,74.8 Q1.1 102.48,75.19 IC1.8
N$6
  Top 0.406: S3.2 25.45,56.95 U$30.A
  Bottom 0.406: S3.2 S3.1
N$7  (via drill 0.6)
  Top 0.406: IC1.29 91.84,66.82 v91.44,66.04 | v77.47,66.04 v83.31,66.04 | U$34.1 77.47,76.83 78.11,77.47 v79.5,77.47 | v73.66,85.09 73.66,80.64 74.42,79.88 | 74.42,79.88 v79.5,79.88 | 74.42,79.88 67.18,79.88 60.32,73.02 40.44,73.02 RESET.1 | R1.1 C4.1 73.15,92.71 73.66,92.2 v73.66,89.97
  Bottom 0.406: v83.31,66.04 v91.44,66.04 | v73.66,85.09 v73.66,89.97 | v77.47,66.04 77.47,72.39 79.88,72.39 81.15,73.66 81.15,76.83 80.52,77.47 v79.5,77.47 v79.5,79.88 | RESET.2 RESET.1
N$8
  Top 0.813: R2.1 60.96,95.25 59.69,93.98 SERIAL_PROG.4
N$9
  Top 0.406: SERIAL_PROG.1 C4.2
N$10  (via drill 0.6)
  Top 0.406: IC1.31 93.44,62.96 91.95,61.47 66.04,61.47 60.58,66.93 56.26,66.93 55.88,67.31 v55.88,68.58 | R5.2 v46.99,80.01
  Bottom 0.406: SERIAL_PROG.2 64.77,90.17 63.5,88.9 55.88,88.9 | 55.88,88.9 52.07,88.9 46.99,83.82 v46.99,80.01 | 55.88,88.9 v55.88,68.58
N$11  (via drill 0.6)
  Top 0.406: IC3.6 63.5,81.28 64.77,82.55 R7.2 66.36,84.14 67.31,85.09 67.31,87.63 66.04,88.9 63.5,88.9 62.23,90.17 SERIAL_PROG.3 | IC1.30 92.64,63.43 91.57,62.36 66.42,62.36 61.09,67.69 57.4,67.69 v57.15,67.94
  Bottom 0.406: v57.15,67.94 57.15,77.47 IC3.6
N$12
  Top 0.813: IC2.1 151.13,21.91 C6.2
  Bottom 0.813: IC2.1 C8.+ 159.77,24.13 160.78,25.15 160.78,34.29 158.11,36.96 158.11,45.09 D1.C D3.C
N$13
  Top 0.406: S2.2 131.88,56.95 U$31.A
  Bottom 0.406: S2.2 S2.1
N$14
  Top 0.406: U$32.A 145.47,56.95 S1.2 S1.1
N$15
  Top 0.406: S4.2 12.12,56.95 U$29.A
  Bottom 0.406: S4.2 S4.1
N$16
  Top 0.406: U$26.A 118.8,39.17 S7.2 S7.1
N$17
  Top 0.406: U$28.A 145.47,39.17 S5.2 S5.1
N$18
  Top 0.406: U$18.A 12.12,39.17 S15.2 S15.1
N$19
  Top 0.406: S14.2 25.45,38.1 25.45,39.17 | 25.45,39.17 U$19.A | 25.45,39.17 S14.1
N$20
  Top 0.406: S9.2 92.25,39.17 U$24.A
  Bottom 0.406: S9.2 S9.1
N$21
  Top 0.406: U$23.A 81.28,41.91 78.79,39.42 S10.2 S10.1
N$22
  Top 0.406: U$27.A 132.13,39.17 S6.2 S6.1
N$23
  Top 0.406: U$22.A 65.46,39.17 S11.2 S11.1
N$24
  Top 0.406: U$21.A 52.12,39.17 S12.2 S12.1
N$25
  Top 0.406: S13.2 38.79,39.17 U$20.A
  Bottom 0.406: S13.2 S13.1
N$26
  Top 0.406: U$13.A 45.77,22.66 S20.2 S20.1
N$27
  Top 0.406: U$14.A 59.11,22.66 S19.2 S19.1
N$28
  Top 0.406: U$15.A 72.44,22.66 S18.2 S18.1
N$29
  Top 0.406: U$16.A 99.11,22.66 S17.2 S17.1
N$30
  Top 0.406: U$17.A 112.45,22.66 S16.2 S16.1
N$31
  Top 0.406: S28.2 39.42,6.15 U$5.A
  Bottom 0.406: S28.2 S28.1
N$32
  Top 0.406: S27.2 52.76,6.15 U$6.A
  Bottom 0.406: S27.2 S27.1
N$33
  Top 0.406: S29.2 19.1,6.15 U$1.A
  Bottom 0.406: S29.2 S29.1
N$34
  Top 0.406: S26.2 66.09,6.15 U$7.A
  Bottom 0.406: S26.2 S26.1
N$35
  Top 0.406: S25.2 79.43,6.15 U$8.A
  Bottom 0.406: S25.2 S25.1
N$36
  Top 0.406: S24.2 92.76,6.15 U$9.A
  Bottom 0.406: S24.2 S24.1
N$37
  Top 0.406: S23.2 106.1,6.15 U$10.A
  Bottom 0.406: S23.2 S23.1
N$38
  Top 0.406: S22.2 119.43,6.28 U$11.A
  Bottom 0.406: S22.2 S22.1 | S22.2 119.43,3.86 119.38,3.81 119.38,3.99 S22.2
N$39
  Top 0.406: S21.2 139.75,6.15 U$12.A
  Bottom 0.406: S21.2 S21.1
N$40
  Top 0.406: U$25.A 105.46,39.17 S8.2 S8.1
N$41
  Bottom 0.813: U$3.P$5 BATT+.1 149.09,82.55 U$2.TIP
N$42
  Bottom 0.813: U$2.RING 147.84,91.44 132.08,91.44 128.27,87.63 128.27,83.82 129.54,82.55 U$3.P$2
N$43
  Bottom 0.813: BATT-.1 143.93,85.09 U$2.RING_SW
N$44
  Top 0.406: R17.1 56.2,82.87 57.15,83.82 IC3.7
N$45
  Top 0.406: IC3.2 52.07,83.82 48.26,80.01 48.26,77.47 | D5.A 48.26,77.47 | R6.2 48.26,77.47
N$46
  Top 0.406: 53.31,81.31 IC3.3 52.07,81.28 50.8,80.01 50.8,74.96 D5.C
  Bottom 0.406: MIDI_IN.5 36.07,80.77 38.1,78.74 49.53,78.74 51.94,81.15 53.21,81.15 IC3.3
N$47
  Top 0.406: R6.1 27.18,77.47 25.91,78.74 MIDI_IN.4
N$48  (via drill 0.6)
  Top 0.406: v30.48,80.01 R5.1
  Bottom 0.406: v30.48,80.01 30.48,81.28 24.13,87.63 17.27,87.63 16.26,86.61 MIDI_OUT.5
N$49
  Top 0.406: MIDI_OUT.4 6.1,86.11 7.62,87.63 39.5,87.63 43.56,83.57 43.56,82.61 R4.2
N$50
  Top 0.406: R8.1 DIAG.C
N$51
  Top 0.406: R12.1 145.73,70.17 LED1.K
N$52
  Top 0.406: IC1.13 91.06,76.68 91.06,80.9 SP.1
N$55
  Bottom 0.813: D3.A D4.C 156.34,54.74 156.34,55.37 160.02,59.05 160.02,77.47 159.38,78.1 132.46,78.1 132.08,78.49 U$3.P$3
N$56
  Top 0.813: U$3.P$4 134.87,80.01 135.38,79.5 135.38,78.36 135.64,78.1 159.38,78.1 160.02,77.47 160.02,59.05 158.11,57.15 158.11,48.9 D1.A
  Bottom 0.813: D2.C D1.A
RET0
  Top 0.406: 94.24,59.31 IC1.32 | 94.24,59.31 58.42,59.31 57.1,57.99 S12.3 | 94.24,59.31 94.24,55.87 97.16,52.96 97.16,49.51 S9.3 | S7.3 123.77,50.11 125.73,52.07 134.21,52.07 S2.4 | R14.1 93,32.7 S9.4 | S1.4 S1.3
  Bottom 0.406: 110.44,38.05 S8.4 110.49,36.98 110.49,40.64 | S7.4 123.83,36.98 123.83,38.1 | S3.3 S3.4 33.07,52.07 43.18,52.07 43.76,51.49 S13.3 | 57.1,50.8 S12.3 57.1,40.64 | S9.3 97.23,40.64 | 97.23,40.64 S9.4 | S13.4 S13.3 | 57.1,40.64 S12.4 | S13.3 43.76,40.69 43.81,40.64 57.1,40.64 | 123.83,38.1 123.83,40.64 110.49,40.64 | 97.23,40.64 110.49,40.64 | S7.3 123.77,38.15 123.83,38.1 | S8.3 110.44,40.69 110.49,40.64 | S1.4 150.44,58.42 136.91,58.42 136.85,57.1 S2.4 S2.3
RET1  (via drill 0.6)
  Top 0.406: IC1.9 94.46,76.68 96.52,78.74 109.22,78.74 111.38,76.58 111.38,62.23 110.49,60.96 v109.22,60.96 | S6.4 S6.3 | S14.3 30.43,50.75 33.02,53.34 v49.53,53.34 | R13.1 86.36,34.34 S10.4
  Bottom 0.406: S16.4 117.42,22.78 | S10.4 96.57,24.13 104.14,24.13 | S10.4 83.77,39.42 | 70.43,39.45 S11.4 70.43,40.64 | 30.43,39.32 S14.4 30.43,40.69 | v109.22,60.96 85.09,60.96 83.82,59.69 83.82,49.48 S10.3 | S4.3 S4.4 17.09,54.03 21.59,49.53 21.59,40.64 30.48,40.64 30.43,40.69 | 70.43,40.64 S11.3 70.43,52.76 69.85,53.34 v49.53,53.34 | S10.3 S10.4 | S5.3 S5.4 150.44,39.55 149.35,40.64 138.18,40.64 137.11,39.57 S6.4 137.11,34.24 135.89,33.02 117.53,33.02 S16.3 S16.4 | 104.14,24.13 117.48,24.13 117.42,24.08 S16.4 | 104.09,24.08 S17.3 | 104.09,24.08 S17.4 | 104.14,24.13 104.09,24.08 | 30.43,40.69 S14.3 | S10.3 83.77,40.69 83.82,40.64 70.43,40.64
RET2  (via drill 0.6)
  Top 0.406: S23.4 111.07,1.85 110.49,1.27 97.79,1.27 97.79,3.86 S24.4 | IC1.10 93.44,78.2 95.25,80.01 109.22,80.01 112.27,76.96 112.27,59.94 113.92,58.29 113.92,37.34 109.6,33.02 107.82,33.02 103.63,28.83 103.63,23.62 101.6,21.59 101.6,17.65 100.33,16.38 97.77,16.38 S24.3 | R16.1 90.17,23.98 v90.02,24.13
  Bottom 0.406: 77.42,23.32 S18.4 77.42,24 | 50.8,24.13 19.05,24.13 17.09,26.09 S15.4 S15.3 | 50.8,24.13 64.01,24.13 | 64.01,24.13 77.55,24.13 | 50.75,23.57 S20.4 S20.3 50.75,24.18 50.8,24.13 | 64.08,24.05 S19.3 | 77.42,24 S18.3 | S24.4 S24.3 v90.02,24.13 88.9,24.13 77.55,24.13 | S23.4 S23.3 | 64.08,24.05 S19.4 | 64.01,24.13 64.08,24.05 | 77.55,24.13 77.42,24
RET3  (via drill 0.6)
  Top 0.406: S29.4 24.08,1.32 24.13,1.27 43.18,1.27 | 43.18,1.27 44.45,2.54 44.45,3.86 S28.4 | S27.4 57.73,1.85 57.15,1.27 | 43.18,1.27 57.15,1.27 | S26.4 71.07,2.49 69.85,1.27 | 57.15,1.27 69.85,1.27 | S25.4 84.4,1.85 83.82,1.27 69.85,1.27 | S21.4 144.73,2.49 143.51,1.27 124.46,1.27 124.46,3.99 S22.4 | IC1.2 97.25,70.39 99.06,68.58 v99.06,52.83 | S22.3 125.73,17.86 125.73,33.02 128.02,35.31 v128.02,36.83 | S25.3 84.4,17.41 R15.1
  Bottom 0.406: S29.4 S29.3 | S28.4 S28.3 | S27.4 S27.3 | S25.3 S25.4 84.4,1.85 84.99,1.27 124.46,1.27 124.41,1.32 S22.4 S22.3 | S21.4 S21.3 | S26.4 S26.3 | v99.06,52.83 126.37,52.83 128.02,51.18 v128.02,36.83
SCAN0  (via drill 0.6)
  Top 0.406: v95.73,56.79 IC1.1 | 134.4,61.98 U$31.C 134.37,63.25 134.62,63.5 | U$27.C 134.62,50.68 136.02,52.07 139.57,52.07 140.46,52.96 140.46,62.61 139.57,63.5 134.62,63.5 | 134.62,63.5 117.09,63.5 116.21,62.61 v116.21,60.96
  Bottom 0.406: v95.73,56.79 113.94,56.79 116.21,58.67 v116.21,60.96
SCAN1  (via drill 0.6)
  Top 0.406: U$28.C 147.96,45.08 147.95,45.09 147.95,51.44 147.32,52.07 141.73,52.07 | IC1.12 91.84,79.52 93.98,81.66 110.24,81.66 114.3,77.6 114.3,70.23 120.14,64.39 v141.73,64.39 141.73,52.07 | U$12.C 142.25,17.78 140.97,19.05 128.27,19.05 127,20.32 127,31.75 129.54,34.29 140.59,34.29 141.73,35.43 141.73,52.07 | U$32.C 147.96,63.75 v147.95,64.39
  Bottom 0.406: v141.73,64.39 v147.95,64.39
SCAN2  (via drill 0.6)
  Top 0.406: U$10.C 108.59,12.07 109.22,12.7 121.93,12.7 | U$11.C 121.93,12.7 | 114.94,29.21 U$17.C | 114.94,29.21 114.94,44.07 114.94,44.84 114.94,52.07 | 121.41,44.29 U$26.C 121.29,51.43 120.65,52.07 114.94,52.07 | X1.14 80.26,89.28 80.77,89.79 88.65,89.79 89.15,89.28 89.15,85.47 90.24,84.38 v90.24,82.55 IC1.14 | 114.94,52.07 v114.94,67.44 | 121.93,12.7 121.93,27.94 120.65,29.21 114.94,29.21
  Bottom 0.406: v114.94,67.44 90.17,67.44 89.41,68.2 89.41,81.72 v90.24,82.55
SCAN3  (via drill 0.6)
  Top 0.406: U$8.C 81.92,12.07 82.55,12.7 95.25,12.7 | 95.25,12.7 U$9.C | 101.6,29.21 U$16.C 101.61,35.56 | U$25.C 107.96,51.56 106.43,53.09 102.74,53.09 101.6,51.94 101.6,44.44 | IC1.15 89.44,78.2 87.63,80.01 v83.82,80.01 82.81,81.02 X1.13 | 95.25,12.7 95.25,32 98.81,35.56 101.61,35.56 | v78.74,57.15 91.44,57.15 95.25,53.34 95.25,47.62 97.16,45.72 100.33,45.72 101.61,44.45 | 101.61,35.56 101.61,44.45 | 101.6,44.44 101.6,43.18 | 101.61,44.45 101.6,44.44 | v80.07,71.18 80.01,71.12 76.58,71.12 76.2,71.5 U$34.4
  Bottom 0.406: v83.82,80.01 83.82,74.93 v80.07,71.18 80.01,71.12 78.74,71.12 v78.74,57.15
SCAN4  (via drill 0.6)
  Top 0.406: IC1.16 88.64,77.73 87.63,78.74 v86.36,78.74 74.93,78.74 U$34.5 | U$15.C 74.68,27.91 74.68,35.56 | U$23.C 81.29,45.47 | U$24.C 94.74,44.96 94.49,45.21 81.54,45.21 81.29,45.47 | U$7.C 68.59,32.01 72.14,35.56 74.68,35.56 | 81.29,45.47 v81.29,46.98 v81.28,46.99 | 74.68,35.56 74.68,51.82 76.2,53.34 v81.28,53.34
  Bottom 0.406: X1.12 86.36,86.29 v86.36,78.74 86.36,73.66 81.28,68.58 v81.28,53.34 v81.28,46.99
SCAN5  (via drill 0.6)
  Top 0.406: U$21.C 54.62,44.45 55.88,45.72 61.6,45.72 | U$22.C 67.95,58.16 67.82,58.29 | IC1.11 92.64,78.92 94.62,80.9 109.73,80.9 113.54,77.09 v113.54,60.83 | 61.6,35.56 U$14.C | U$6.C 55.25,32.14 58.67,35.56 61.6,35.56 | 61.6,35.56 61.6,45.72 | 61.6,45.72 61.6,57.54 62.36,58.29 67.82,58.29 | 67.82,58.29 v86.36,58.29
  Bottom 0.406: v86.36,58.29 86.49,58.29 87.38,59.18 112.52,59.18 113.54,60.2 v113.54,60.83
SCAN6  (via drill 0.6)
  Top 0.406: IC1.23 85.12,70.39 v85.09,70.36 83.31,68.58 v71.12,68.58 | U$13.C 47.88,28.04 47.88,35.69 | U$5.C 41.91,32.01 45.47,35.56 47.75,35.56 47.88,35.69 | U$19.C 27.95,45.72 27.94,45.72 41.4,45.72 | 47.88,35.69 47.88,45.34 | 41.4,45.72 47.5,45.72 47.88,45.34 | U$20.C 41.28,45.6 41.4,45.72 | 47.88,45.34 47.88,49.15 52.07,53.34 54.74,53.34 55.88,54.48 55.88,58.29 58.17,60.58 58.17,63.88 59.05,64.77 v59.69,64.77
  Bottom 0.406: X1.11 87.88,71.91 86.36,70.39 85.12,70.39 v85.09,70.36 | v71.12,68.58 71.12,64.77 v59.69,64.77
SCAN7  (via drill 0.6)
  Top 0.406: U$1.C 21.59,44.45 | U$18.C 14.61,45.09 15.24,45.72 20.32,45.72 21.59,44.45 | U$29.C 14.61,62.87 15.24,63.5 21.59,63.5 | 21.59,63.5 27.94,63.5 | 27.94,63.5 U$30.C 27.95,63.49 | 21.59,44.45 v21.59,52.07 21.59,63.5 | IC1.24 86.1,69.59 83.82,67.31 v73.66,67.31 | X1.4 105.67,89.91 v105.41,90.17 | 27.94,63.5 27.95,63.49 | 27.95,63.49 50.16,63.49 52.83,66.17 60.2,66.17 65.91,60.45 v73.66,60.45
  Bottom 0.406: v105.41,90.17 79.88,90.17 78.99,89.28 78.99,85.09 77.72,83.82 69.85,83.82 68.58,82.55 68.58,71.12 69.85,69.85 73.41,69.85 73.66,69.6 v73.66,67.31 v73.66,60.45
VDD  (via drill 0.6)  (1 unrouted)
  Top 0.406: R7.1 64.45,86.36 IC3.8 55.88,86.36 54.61,85.09 50.8,85.09 48.26,82.55 R4.1 | 92.71,73.59 92.53,73.59 91.73,74.39 IC1.18 84.11,74.39 C1.1 82.74,74.1 82.55,74.29 | 92.71,73.59 IC1.6 92.64,73.59 v92.58,73.53 | 91.91,72.79 IC1.20 | 92.71,73.59 91.91,72.79 | IC1.4 92.71,71.99 91.91,72.79 | v70.48,85.72 v70.48,82.55 | v82.55,77.47 82.55,74.29 | 82.55,74.29 82.55,72.77 82.17,72.39 77.72,72.39 77.47,72.64 U$34.2 | R1.2 68.83,90.17 68.58,89.92 v68.58,88.27
  Top 0.813: X1.2 110.74,90.55 109.6,91.69 R3.2 R2.2 | IC2.3 151.13,31.43 C5.2
  Bottom 0.406: X1.2 110.74,85.34 | v70.48,82.55 81.28,82.55 82.55,81.28 v82.55,77.47 | 128.27,74.68 CONTRAST.1 | v70.48,85.72 69.85,86.36 68.58,86.36 | IC3.8 68.58,86.36 | 68.58,86.36 v68.58,88.27
  Bottom 0.813: C7.+ IC2.3 151.26,29.34 151.26,32.89 154.3,35.94 154.3,56.26 154.94,57.15 154.94,67.31 151.13,71.12 LED1.A 149.22,74.04 148.59,74.68 128.27,74.68 119.63,74.68 110.74,83.57 | 110.74,83.57 X1.2 | 110.74,83.57 100.08,83.57 92.71,76.2 | v92.58,73.53 92.58,76.07

### Text on the board
tPlace: MIDIOT | MIDIOT | chord progress | rev 1 | hotchk155
tDocu: ICSP | All key matrix diodes | 1N4148 equiv